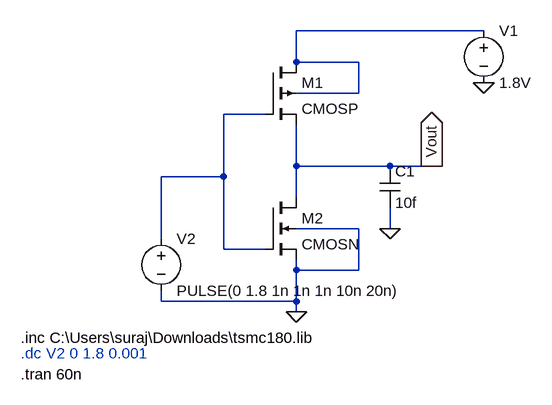
[diagram p0: schematic CMOS_Inverter(tsmc180nm).asc]
CMOS_Inverter(tsmc180nm).asc, the LTspice schematic file:
Version 4
SHEET 1 880 680
WIRE 464 16 176 16
WIRE 176 64 176 16
WIRE 272 64 176 64
WIRE 272 112 272 64
WIRE 272 112 176 112
WIRE 128 144 64 144
WIRE 176 224 176 160
WIRE 320 224 176 224
WIRE 384 224 320 224
WIRE 400 224 384 224
WIRE 64 240 64 144
WIRE 64 240 -32 240
WIRE 176 272 176 224
WIRE 272 320 176 320
WIRE 320 320 320 288
WIRE -32 336 -32 240
WIRE 64 352 64 240
WIRE 128 352 64 352
WIRE 176 384 176 368
WIRE 272 384 272 320
WIRE 272 384 176 384
WIRE -32 432 -32 416
WIRE 176 432 176 384
WIRE 176 432 -32 432
WIRE 176 448 176 432
FLAG 176 448 0
FLAG 464 96 0
FLAG 320 320 0
FLAG 384 224 Vout
IOPIN 384 224 Out
SYMBOL pmos4 128 64 R0
SYMATTR InstName M1
SYMATTR Value CMOSP
SYMATTR Value2 l=0.18u w=4u
SYMBOL nmos4 128 272 R0
SYMATTR InstName M2
SYMATTR Value CMOSN
SYMATTR Value2 l=0.18u w=2u
SYMBOL voltage 464 0 R0
WINDOW 123 0 0 Left 0
WINDOW 39 0 0 Left 0
SYMATTR InstName V1
SYMATTR Value 1.8V
SYMBOL voltage -32 320 R0
WINDOW 123 0 0 Left 0
WINDOW 39 0 0 Left 0
SYMATTR InstName V2
SYMATTR Value PULSE(0 1.8 1n 1n 1n 10n 20n)
SYMBOL cap 304 224 R0
SYMATTR InstName C1
SYMATTR Value 10f
TEXT -248 488 Left 2 !.inc C:\\Users\\suraj\\Downloads\\tsmc180.lib
TEXT -248 512 Left 2 ;.dc V2 0 1.8 0.001
TEXT -248 544 Left 2 !.tran 60n

The netlist it stands for:
* CMOS_Inverter(tsmc180nm).asc
M1 N001 N002 Vout N001 CMOSP l=0.18u w=4u
M2 Vout N002 0 0 CMOSN l=0.18u w=2u
V1 N001 0 1.8V
V2 N002 0 PULSE(0 1.8 1n 1n 1n 10n 20n)
C1 Vout 0 10f
.model NMOS NMOS
.model PMOS PMOS
.lib standard.mos
.inc C:\Users\suraj\Downloads\tsmc180.lib
* .dc V2 0 1.8 0.001
.tran 60n
.backanno
.end